# Altium schematic sheet voltageRegulator.SchDoc
size A4
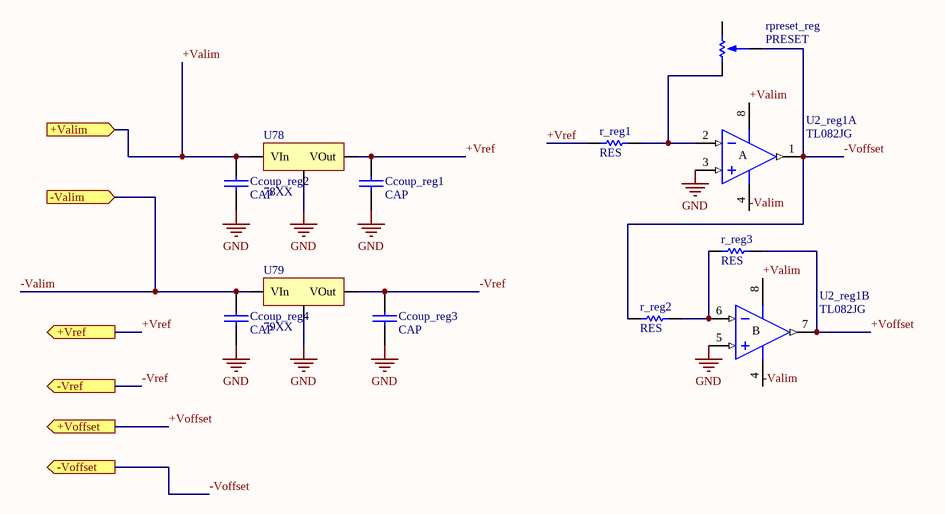
[diagram p0: voltageRegulator.SchDoc]

## Parts
Ccoup_reg1  CAP  [CAP200]
Ccoup_reg2  CAP  [CAP200]
Ccoup_reg3  CAP  [CAP200]
Ccoup_reg4  CAP  [CAP200]
r_reg1  RES  [RES300]
r_reg2  RES  [RES300]
r_reg3  RES  [RES300]
rpreset_reg  PRESET  [PRESET V]
U2_reg1  TL082JG  [JG008]  (parts A,B of 2)
U78  78XX  [TO-220 H - DISIPADOR]
U79  79XX  [TO-220 H - DISIPADOR]

## Ports
+Valim (in), +Voffset (out), +Vref (out), -Valim (in), -Voffset (out), -Vref (out)

## Nets
GND: Ccoup_reg1.2 Ccoup_reg2.2 Ccoup_reg3.2 Ccoup_reg4.2 U2_reg1.3(IN+) U2_reg1.5(IN+) U78.2(GND) U79.1(GND)
+Valim: Ccoup_reg2.1 U2_reg1.8(V+) U78.1(VIn) ; port +Valim
+Voffset: r_reg3.2 U2_reg1.7(OUT) ; port +Voffset
+Vref: Ccoup_reg1.1 r_reg1.1 U78.3(VOut) ; port +Vref
-Valim: Ccoup_reg4.1 U2_reg1.4(V-) U79.2(VIn) ; port -Valim
-Voffset: r_reg2.1 rpreset_reg.2 U2_reg1.1(OUT) ; port -Voffset
-Vref: Ccoup_reg3.1 U79.3(VOut) ; port -Vref
Netr_reg1_2: r_reg1.2 rpreset_reg.3 U2_reg1.2(IN-)
Netr_reg2_2: r_reg2.2 r_reg3.1 U2_reg1.6(IN-)

Not connected (* = marked no-connect by the designer): rpreset_reg 1

## Notes on the sheet
- (in symbol TL082JG, part A) A
- (in symbol TL082JG, part B) B

## Library data of the parts
U2_reg1 = TL082JG: JFET-Input Operational Amplifier; Published: 16-Jan-2001; LatestRevisionDate: 04-Mar-2005; LatestRevisionNote: Stylized 3D Model Added.; DatasheetVersion: Feb-1999; PackageVersion: Jan-1995; PackageReference: JG008; Publisher: Altium Limited; PackageDescription: DIP; 8 Leads; Row Spacing 7.62 mm; Pitch 2.54 mm; ComponentLink1Description: Manufacturer Link; ComponentLink1URL: http://www.ti.com/; ComponentLink2Description: Datasheet; ComponentLink2URL: http://www-s.ti.com/sc/ds/tl082.pdf
U78 = 78XX: REGULDOR POSITIVO
U79 = 79XX: REGULADOR NEGATIVO